# Altium project 机载动力寻优.PrjPcb
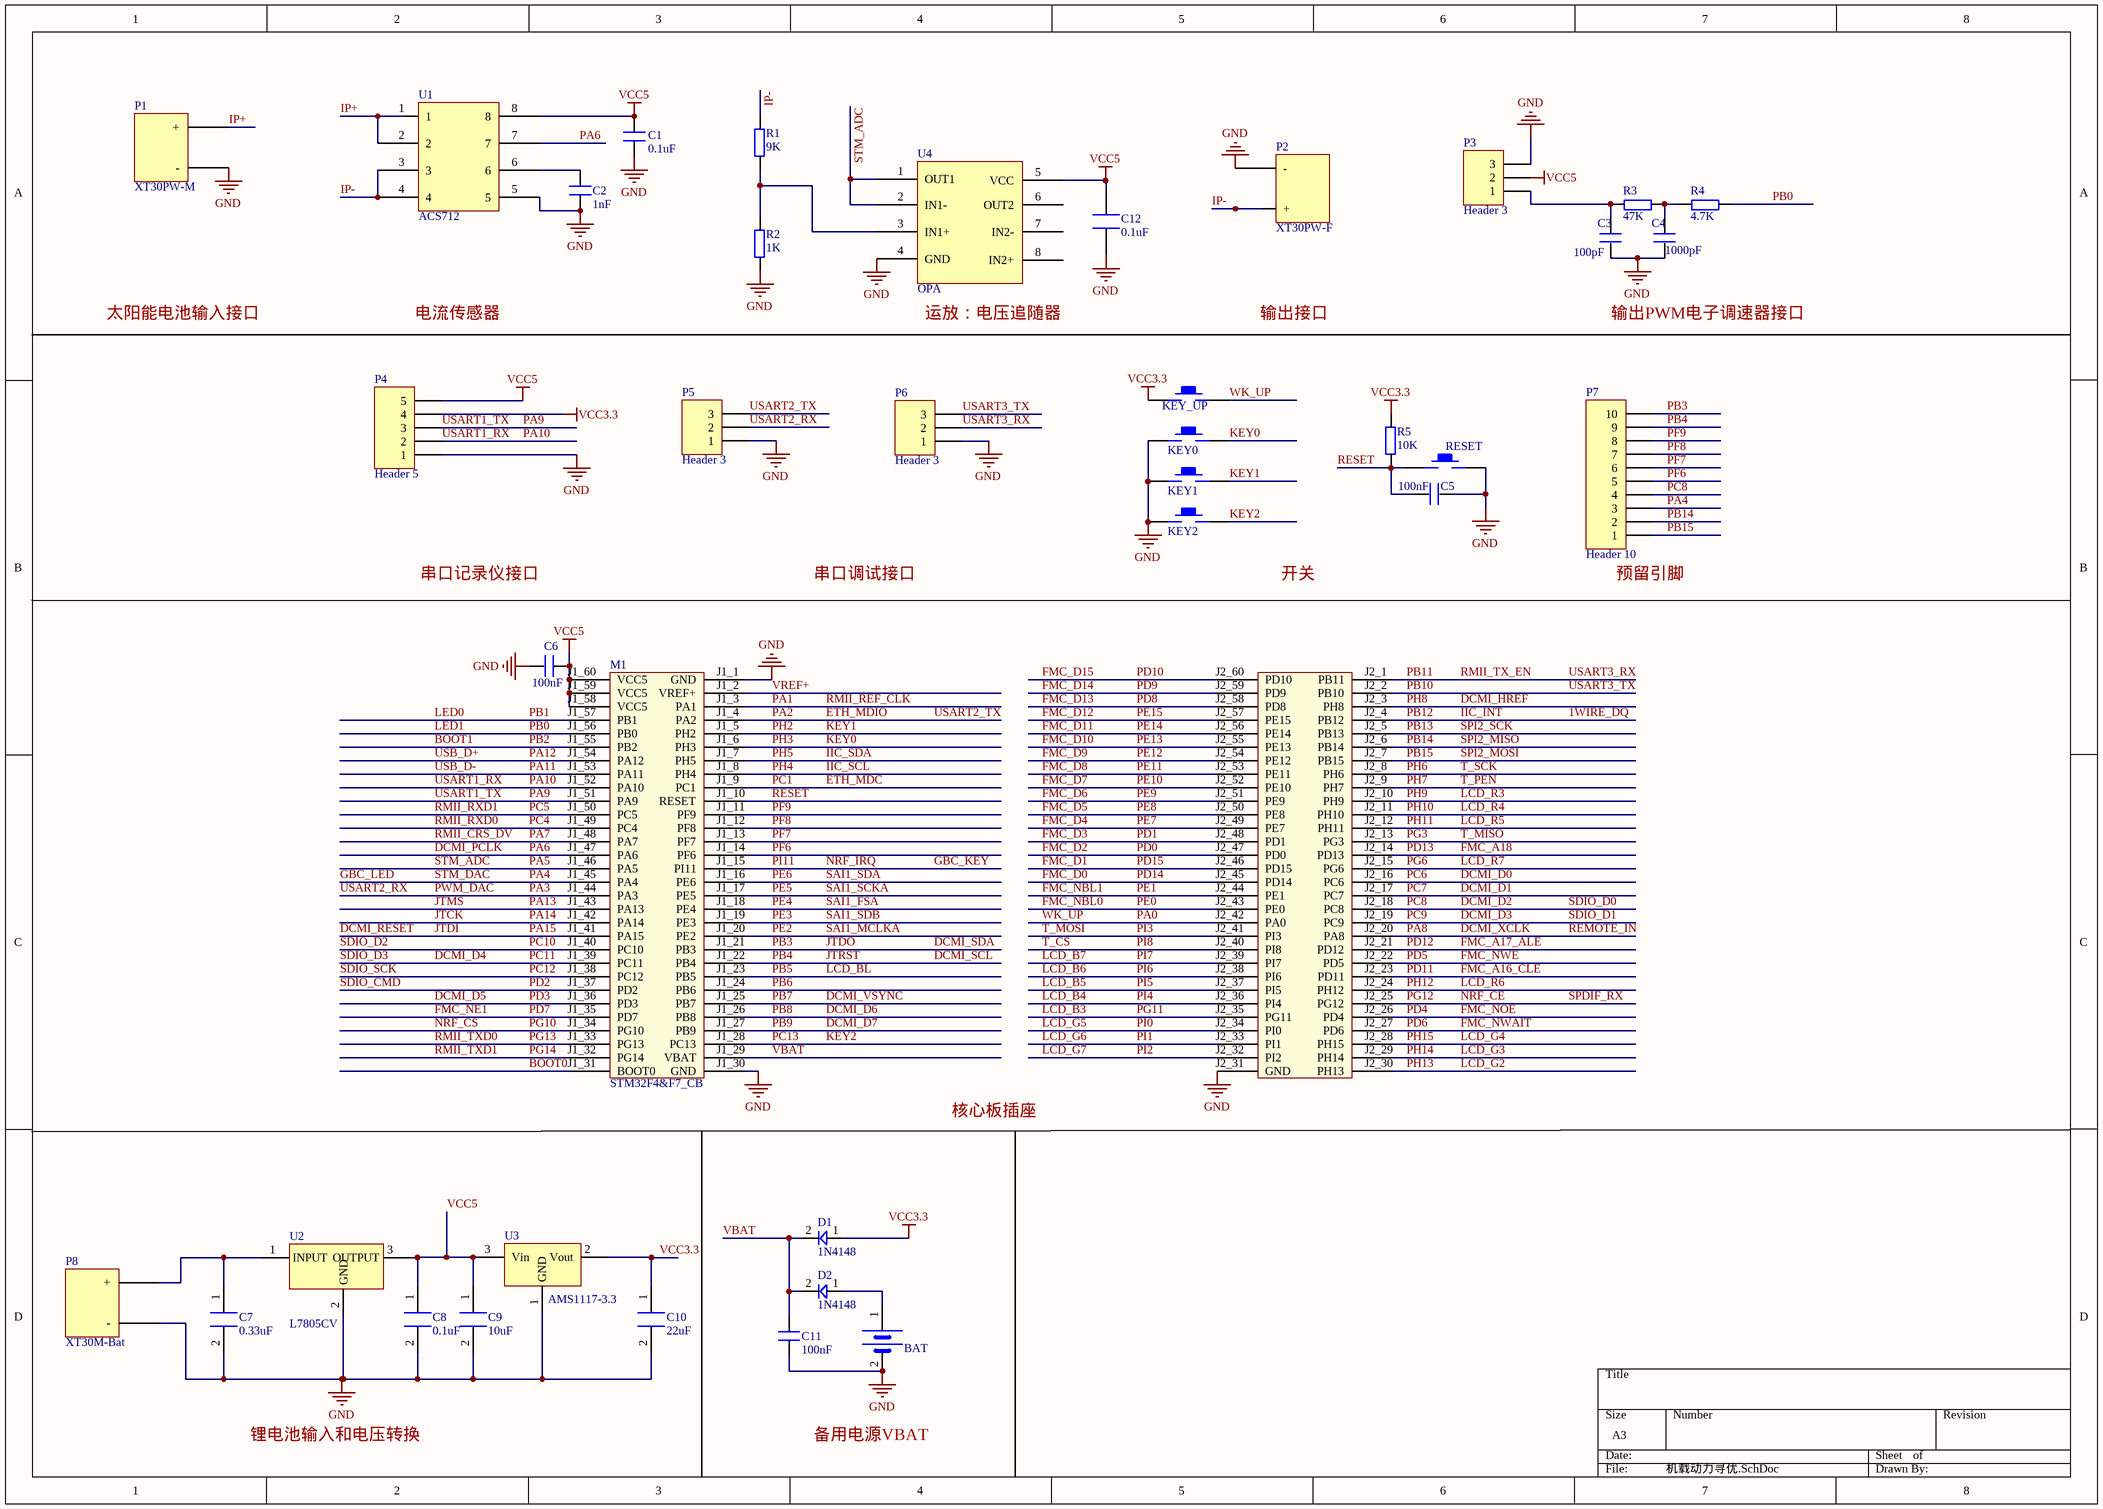
[diagram p0: 机载动力寻优.SchDoc]
1 sheet, 38 parts. Net scope: global (net labels, ports and power ports of the same name join across sheets).
Board file: 机载动力寻优.PcbDoc

## Sheet 机载动力寻优.SchDoc
size A3

### Parts
BAT  BATT  [BATM]  (value not drawn)
C1  0.1uF  [0603P]
C2  1nF  [0603P]
C3  100pF  [0603P]
C4  1000pF  [0603P]
C5  100nF  [0603P]
C6  100nF  [0603P]
C7  0.33uF  [0603P]
C8  0.1uF  [0603P]
C9  10uF  [0603P]
C10  22uF  [0603P]
C11  100nF  [0603P]
C12  0.1uF  [0603P]
D1  1N4148  [DIODE_SOP]
D2  1N4148  [DIODE_SOP]
KEY0  KEY_M  [KEY_M]  (value not drawn)
KEY1  KEY_M  [KEY_M]  (value not drawn)
KEY2  KEY_M  [KEY_M]  (value not drawn)
KEY_UP  KEY_M  [KEY_M]  (value not drawn)
M1  STM32F4&F7_CB  [STM32F4&F7_CB]
P1  XT30PW-M  [XT30PW-M]
P2  XT30PW-F  [XT30PW-F]
P3  Header 3  [串口]
P4  Header 5  [串口数据记录仪]
P5  Header 3  [串口]
P6  Header 3  [串口]
P7  Header 10  [IO口]
P8  XT30M-Bat  [XT30PW-M]
R1  9K  [0603P]
R2  1K  [0603P]
R3  47K  [0603P]
R4  4.7K  [0603P]
R5  10K  [0603P]
RESET  KEY_M  [KEY_M]  (value not drawn)
U1  ACS712  [ACS712]
U2  L7805CV  [TO-220-3]
U3  AMS1117-3.3  [SOT-223]
U4  OPA  [OPA]

### Nets
GND: BAT.2(GND) C1.1 C2.1 C3.1 C4.1 C5.2 C6.1 C7.2 C8.2 C9.2 C10.2 C11.1 C12.1 KEY0.1 KEY1.1 KEY2.1 M1.J1_1(GND) M1.J1_30(GND) M1.J2_31(GND) P1.2(-) P2.2(-) P3.3 P4.1 P5.1 P6.1 P8.2(-) R2.2 RESET.2 U1.5 U2.2(GND) U3.1(GND) U4.4(GND)
VCC3.3: C10.1 D1.1 KEY_UP.1 P4.4 R5.1 U3.2(Vout)
VCC5: C1.2 C6.2 C8.1 C9.1 C12.2 M1.J1_58(VCC5) M1.J1_59(VCC5) M1.J1_60(VCC5) P3.2 P4.5 U1.8 U2.3(OUTPUT) U3.3(Vin) U4.5(VCC)
1WIRE_DQ: M1.J2_4(PB12)  [also labelled IIC_INT, PB12]
BOOT0: M1.J1_31(BOOT0)
BOOT1: M1.J1_55(PB2)  [also labelled PB2]
DCMI_D0: M1.J2_16(PC6)  [also labelled PC6]
DCMI_D1: M1.J2_17(PC7)  [also labelled PC7]
DCMI_D2: M1.J2_18(PC8) P7.4  [also labelled PC8, SDIO_D0]
DCMI_D3: M1.J2_19(PC9)  [also labelled PC9, SDIO_D1]
DCMI_D4: M1.J1_39(PC11)  [also labelled PC11, SDIO_D3]
DCMI_D5: M1.J1_36(PD3)  [also labelled PD3]
DCMI_D6: M1.J1_26(PB8)  [also labelled PB8]
DCMI_D7: M1.J1_27(PB9)  [also labelled PB9]
DCMI_HREF: M1.J2_3(PH8)  [also labelled PH8]
DCMI_PCLK: M1.J1_47(PA6) U1.7  [also labelled PA6]
DCMI_RESET: M1.J1_41(PA15)  [also labelled JTDI, PA15]
DCMI_SCL: M1.J1_22(PB4) P7.9  [also labelled JTRST, PB4]
DCMI_SDA: M1.J1_21(PB3) P7.10  [also labelled JTDO, PB3]
DCMI_VSYNC: M1.J1_25(PB7)  [also labelled PB7]
DCMI_XCLK: M1.J2_20(PA8)  [also labelled PA8, REMOTE_IN]
ETH_MDC: M1.J1_9(PC1)  [also labelled PC1]
ETH_MDIO: M1.J1_4(PA2) P5.3  [also labelled PA2, USART2_TX]
FMC_A16_CLE: M1.J2_23(PD11)  [also labelled PD11]
FMC_A17_ALE: M1.J2_21(PD12)  [also labelled PD12]
FMC_A18: M1.J2_14(PD13)  [also labelled PD13]
FMC_D0: M1.J2_45(PD14)  [also labelled PD14]
FMC_D1: M1.J2_46(PD15)  [also labelled PD15]
FMC_D2: M1.J2_47(PD0)  [also labelled PD0]
FMC_D3: M1.J2_48(PD1)  [also labelled PD1]
FMC_D4: M1.J2_49(PE7)  [also labelled PE7]
FMC_D5: M1.J2_50(PE8)  [also labelled PE8]
FMC_D6: M1.J2_51(PE9)  [also labelled PE9]
FMC_D7: M1.J2_52(PE10)  [also labelled PE10]
FMC_D8: M1.J2_53(PE11)  [also labelled PE11]
FMC_D9: M1.J2_54(PE12)  [also labelled PE12]
FMC_D10: M1.J2_55(PE13)  [also labelled PE13]
FMC_D11: M1.J2_56(PE14)  [also labelled PE14]
FMC_D12: M1.J2_57(PE15)  [also labelled PE15]
FMC_D13: M1.J2_58(PD8)  [also labelled PD8]
FMC_D14: M1.J2_59(PD9)  [also labelled PD9]
FMC_D15: M1.J2_60(PD10)  [also labelled PD10]
FMC_NBL0: M1.J2_43(PE0)  [also labelled PE0]
FMC_NBL1: M1.J2_44(PE1)  [also labelled PE1]
FMC_NE1: M1.J1_35(PD7)  [also labelled PD7]
FMC_NOE: M1.J2_26(PD4)  [also labelled PD4]
FMC_NWAIT: M1.J2_27(PD6)  [also labelled PD6]
FMC_NWE: M1.J2_22(PD5)  [also labelled PD5]
GBC_KEY: M1.J1_15(PI11)  [also labelled NRF_IRQ, PI11]
GBC_LED: M1.J1_45(PA4) P7.3  [also labelled PA4, STM_DAC]
IIC_SCL: M1.J1_8(PH4)  [also labelled PH4]
IIC_SDA: M1.J1_7(PH5)  [also labelled PH5]
IP+: P1.1(+) U1.1 U1.2
IP-: P2.1(+) R1.1 U1.3 U1.4
JTCK: M1.J1_42(PA14)  [also labelled PA14]
JTMS: M1.J1_43(PA13)  [also labelled PA13]
KEY0: KEY0.2 M1.J1_6(PH3)  [also labelled PH3]
KEY1: KEY1.2 M1.J1_5(PH2)  [also labelled PH2]
KEY2: KEY2.2 M1.J1_28(PC13)  [also labelled PC13]
LCD_B3: M1.J2_35(PG11)  [also labelled PG11]
LCD_B4: M1.J2_36(PI4)  [also labelled PI4]
LCD_B5: M1.J2_37(PI5)  [also labelled PI5]
LCD_B6: M1.J2_38(PI6)  [also labelled PI6]
LCD_B7: M1.J2_39(PI7)  [also labelled PI7]
LCD_BL: M1.J1_23(PB5)  [also labelled PB5]
LCD_G2: M1.J2_30(PH13)  [also labelled PH13]
LCD_G3: M1.J2_29(PH14)  [also labelled PH14]
LCD_G4: M1.J2_28(PH15)  [also labelled PH15]
LCD_G5: M1.J2_34(PI0)  [also labelled PI0]
LCD_G6: M1.J2_33(PI1)  [also labelled PI1]
LCD_G7: M1.J2_32(PI2)  [also labelled PI2]
LCD_R3: M1.J2_10(PH9)  [also labelled PH9]
LCD_R4: M1.J2_11(PH10)  [also labelled PH10]
LCD_R5: M1.J2_12(PH11)  [also labelled PH11]
LCD_R6: M1.J2_24(PH12)  [also labelled PH12]
LCD_R7: M1.J2_15(PG6)  [also labelled PG6]
LED0: M1.J1_57(PB1)  [also labelled PB1]
LED1: M1.J1_56(PB0) R4.2  [also labelled PB0]
NRF_CE: M1.J2_25(PG12)  [also labelled PG12, SPDIF_RX]
NRF_CS: M1.J1_34(PG10)  [also labelled PG10]
PA0: KEY_UP.2 M1.J2_42(PA0)  [also labelled WK_UP]
PA1: M1.J1_3(PA1)  [also labelled RMII_REF_CLK]
PA3: M1.J1_44(PA3) P5.2  [also labelled PWM_DAC, USART2_RX]
PA5: M1.J1_46(PA5) U4.1(OUT1) U4.2(IN1-)  [also labelled STM_ADC]
PA7: M1.J1_48(PA7)  [also labelled RMII_CRS_DV]
PA9: M1.J1_51(PA9) P4.3  [also labelled USART1_TX]
PA10: M1.J1_52(PA10) P4.2  [also labelled USART1_RX]
PA11: M1.J1_53(PA11)  [also labelled USB_D-]
PA12: M1.J1_54(PA12)  [also labelled USB_D+]
PB6: M1.J1_24(PB6)
PB10: M1.J2_2(PB10) P6.3  [also labelled USART3_TX]
PB11: M1.J2_1(PB11) P6.2  [also labelled RMII_TX_EN, USART3_RX]
PB13: M1.J2_5(PB13)  [also labelled SPI2_SCK]
PB14: M1.J2_6(PB14) P7.2  [also labelled SPI2_MISO]
PB15: M1.J2_7(PB15) P7.1  [also labelled SPI2_MOSI]
PC4: M1.J1_49(PC4)  [also labelled RMII_RXD0]
PC5: M1.J1_50(PC5)  [also labelled RMII_RXD1]
PC10: M1.J1_40(PC10)  [also labelled SDIO_D2]
PC12: M1.J1_38(PC12)  [also labelled SDIO_SCK]
PD2: M1.J1_37(PD2)  [also labelled SDIO_CMD]
PE2: M1.J1_20(PE2)  [also labelled SAI1_MCLKA]
PE3: M1.J1_19(PE3)  [also labelled SAI1_SDB]
PE4: M1.J1_18(PE4)  [also labelled SAI1_FSA]
PE5: M1.J1_17(PE5)  [also labelled SAI1_SCKA]
PE6: M1.J1_16(PE6)  [also labelled SAI1_SDA]
PF6: M1.J1_14(PF6) P7.5
PF7: M1.J1_13(PF7) P7.6
PF8: M1.J1_12(PF8) P7.7
PF9: M1.J1_11(PF9) P7.8
PG3: M1.J2_13(PG3)  [also labelled T_MISO]
PG13: M1.J1_33(PG13)  [also labelled RMII_TXD0]
PG14: M1.J1_32(PG14)  [also labelled RMII_TXD1]
PH6: M1.J2_8(PH6)  [also labelled T_SCK]
PH7: M1.J2_9(PH7)  [also labelled T_PEN]
PI3: M1.J2_41(PI3)  [also labelled T_MOSI]
PI8: M1.J2_40(PI8)  [also labelled T_CS]
RESET: C5.1 M1.J1_10(RESET) R5.2 RESET.1
VBAT: C11.2 D1.2 D2.2 M1.J1_29(VBAT)
VREF+: M1.J1_2(VREF+)
NetBAT_1: BAT.1(VCC) D2.1
NetC2_2: C2.2 U1.6
NetC3_2: C3.2 P3.1 R3.1
NetC4_2: C4.2 R3.2 R4.1
NetC7_1: C7.1 P8.1(+) U2.1(INPUT)
NetR1_2: R1.2 R2.1 U4.3(IN1+)

Not connected (* = marked no-connect by the designer): U4 6(OUT2) 7(IN2-) 8(IN2+)

### Notes on the sheet
- 太阳能电池输入接口
- 电流传感器
- (near U4) 运放：电压追随器
- 输出接口
- 输出PWM电子调速器接口
- 串口记录仪接口
- 串口调试接口
- 开关
- (near P7) 预留引脚
- (near M1) 核心板插座
- 锂电池输入和电压转换
- 备用电源VBAT

### Library data of the parts
BAT = BAT: 电源
C1-C6 C11 = C
C7-C10 C12 = CAP: 电容
D1 D2 = D: 二极管
M1 = STM32F4&F7_CB: F429/746 Core Board
P3 P5 P6 = Header 3: Header, 3-Pin; LatestRevisionDate: 17-Jul-2002; LatestRevisionNote: Re-released for DXP Platform.; Publisher: Altium Limited
P4 = Header 5: Header, 5-Pin; LatestRevisionDate: 17-Jul-2002; LatestRevisionNote: Re-released for DXP Platform.; Publisher: Altium Limited
P7 = Header 10: Header, 10-Pin; LatestRevisionDate: 17-Jul-2002; LatestRevisionNote: Re-released for DXP Platform.; Publisher: Altium Limited
P8 = XT30: 公头
R1-R5 = R
U2 = L7805CV: IC
U3 = AMS1117-3.3: IC
U4 = OPA: 运放器